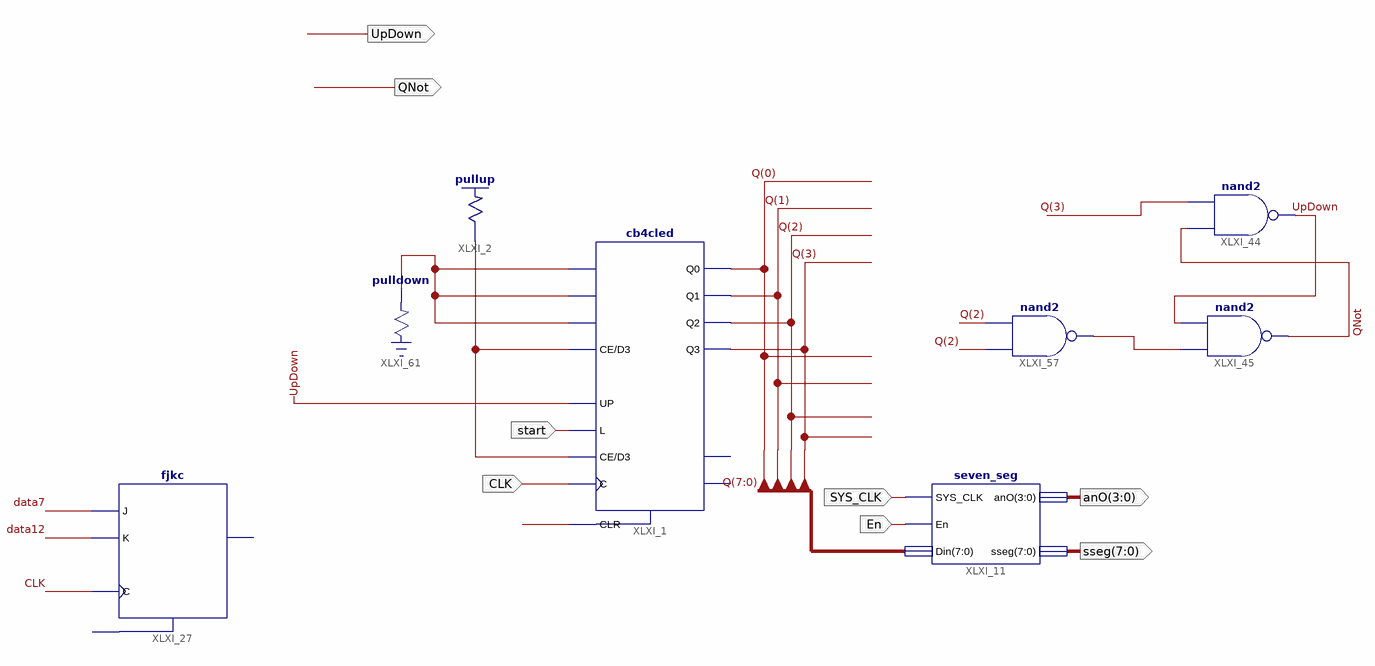
[diagram p0: schematic sheet 1]
// Xilinx ISE schematic Exp7.sch (spartan3e) as structural Verilog: 8 symbols, 8 ports
module Exp7 (
  input  CLK,
  input  En,
  input  SYS_CLK,
  input  start,
  output [3:0] anO,
  output [7:0] sseg,
  output UpDown,
  output QNot
);

  wire data7, data12, XLXN_5, XLXN_229, XLXN_240, XLXN_241;
  wire [7:0] Q;

  cb4cled XLXI_1 (
    .C(CLK), .CE(XLXN_240), .CLR(XLXN_5), .D0(XLXN_241), .D1(XLXN_241), .D2(XLXN_241), .D3(XLXN_240),
    .L(start), .UP(UpDown), .Q0(Q[0]), .Q1(Q[1]), .Q2(Q[2]), .Q3(Q[3]));  // open: CEO, TC
  \pullup  XLXI_2 (.O(XLXN_240));
  seven_seg XLXI_11 (.SYS_CLK(SYS_CLK), .En(En), .Din(Q), .anO(anO), .sseg(sseg));
  fjkc XLXI_27 (.C(CLK), .J(data7), .K(data12));  // open: CLR, Q
  nand XLXI_45 (QNot, XLXN_229, UpDown);
  nand XLXI_44 (UpDown, QNot, Q[3]);
  nand XLXI_57 (XLXN_229, Q[2], Q[2]);
  \pulldown  XLXI_61 (.O(XLXN_241));
endmodule
